# EAGLE schematic hardhat (EAGLE 5.10)
REV: 1; TITLE: Hardhat

## Sheet 1 of 4
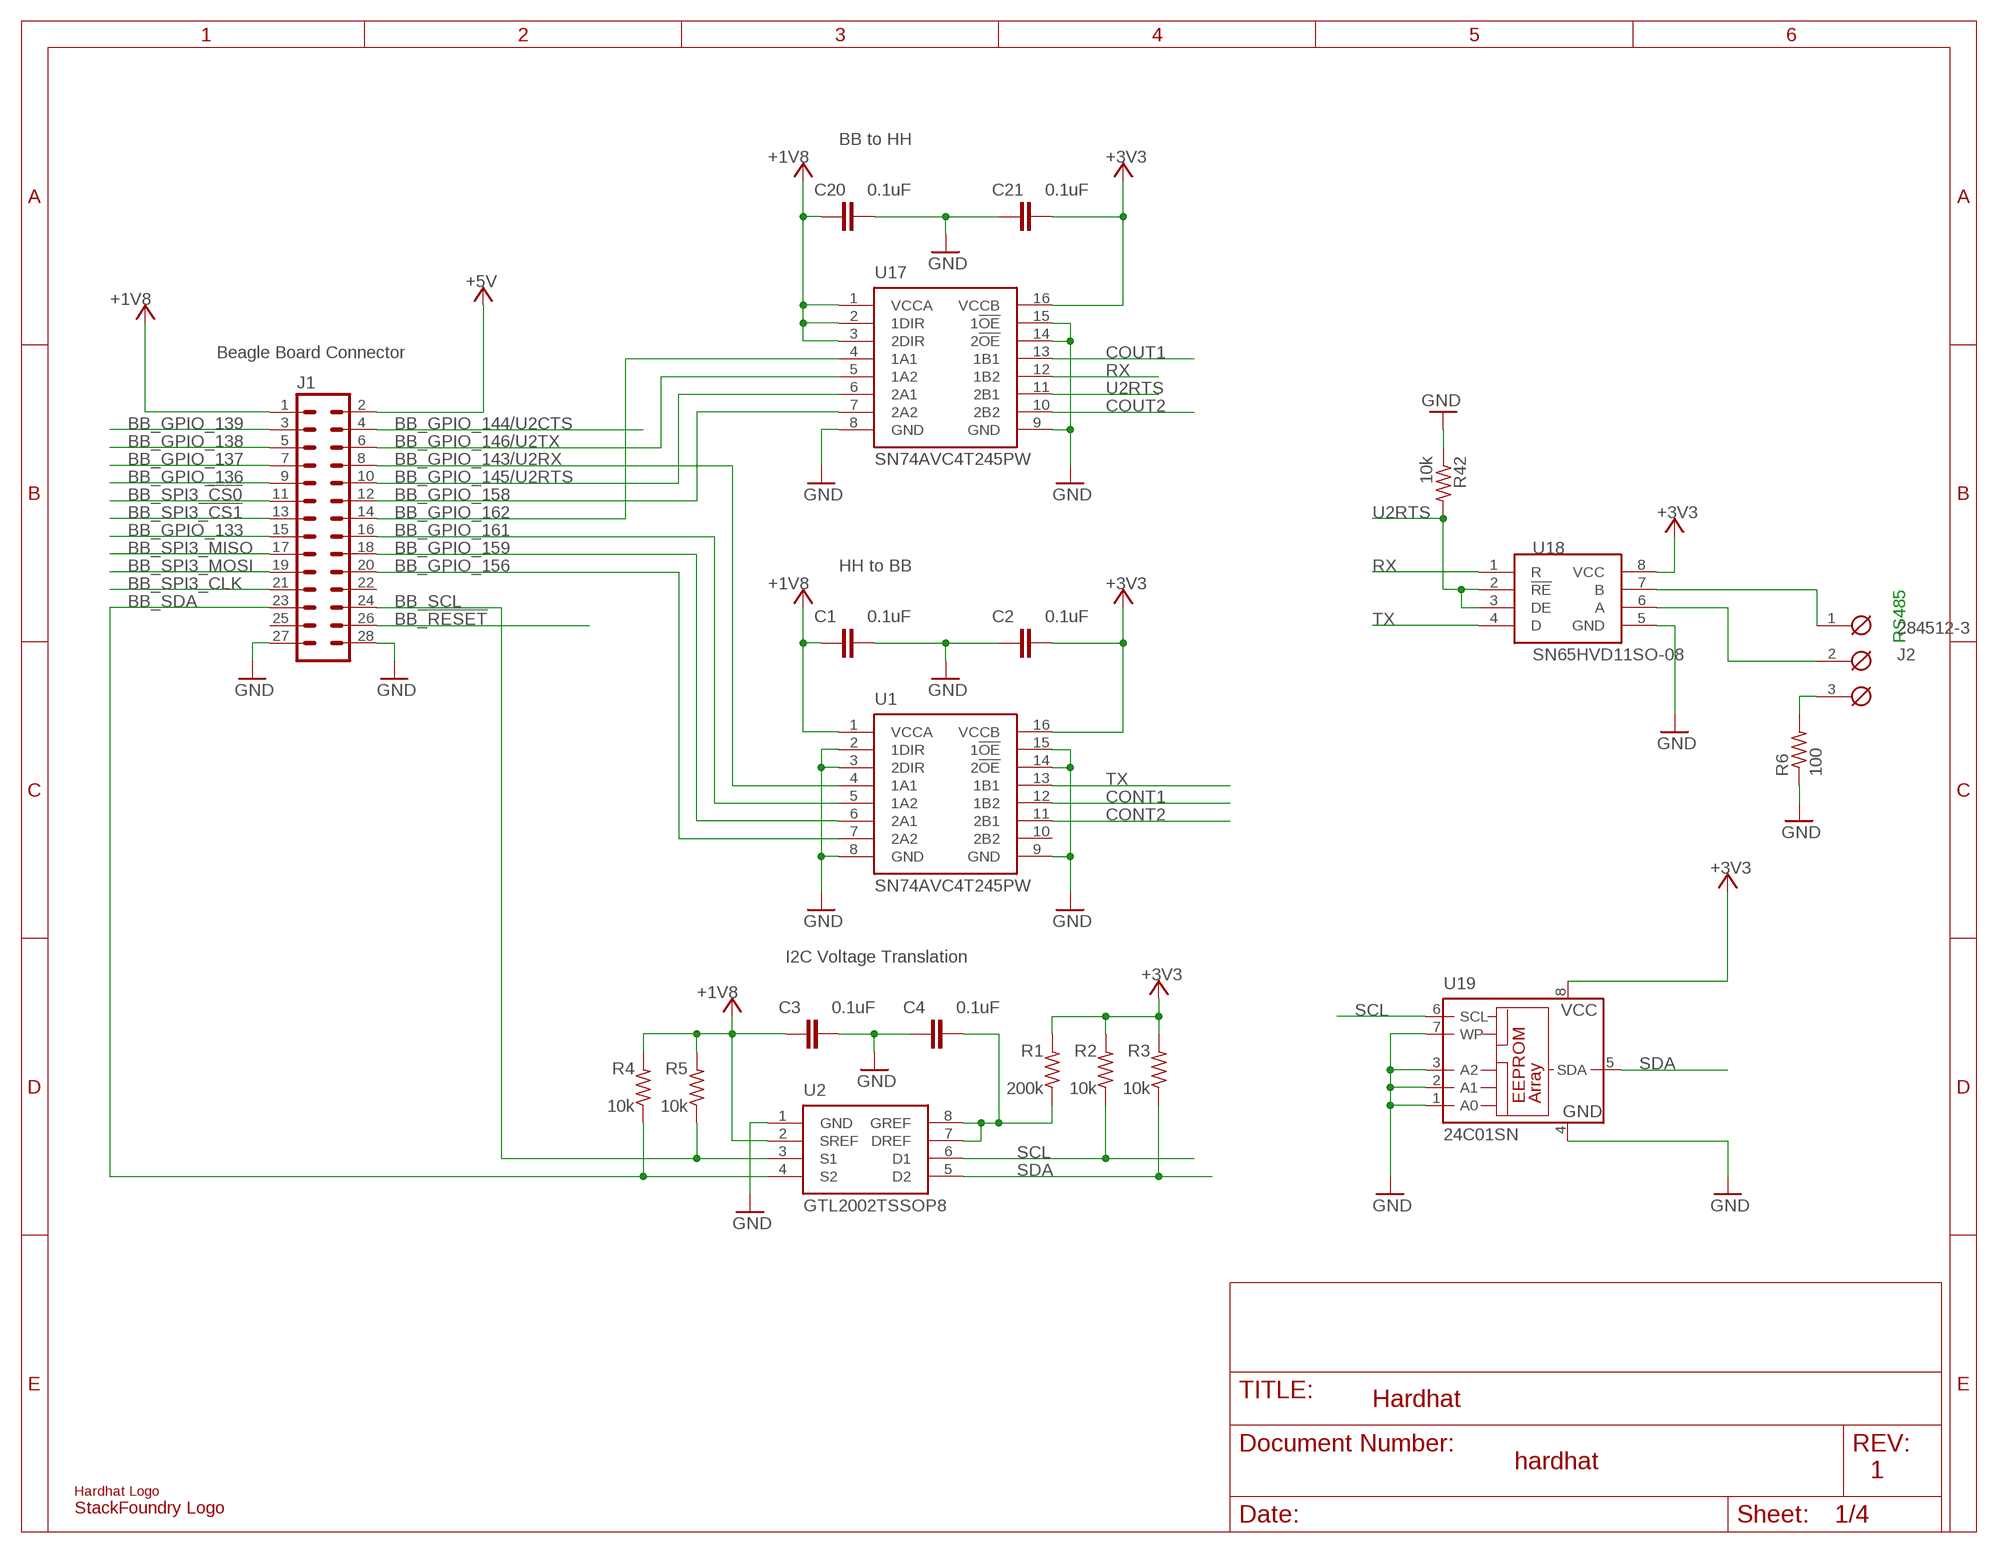
[diagram p0: schematic, sheet 1]

### Parts
C1  0.1uF  C-EUC0603  [C0603]
C2  0.1uF  C-EUC0603  [C0603]
C3  0.1uF  C-EUC0603  [C0603]
C4  0.1uF  C-EUC0603  [C0603]
C20  0.1uF  C-EUC0603  [C0603]
C21  0.1uF  C-EUC0603  [C0603]
J1  MA14-2MA14-2M  [MA14-2M]
J2  284512-3  [284512-3]
LOGO1  SFLOGO  [SFLOGO]
R1  200k  R-US_R0603  [R0603]
R2  10k  R-US_R0603  [R0603]
R3  10k  R-US_R0603  [R0603]
R4  10k  R-US_R0603  [R0603]
R5  10k  R-US_R0603  [R0603]
R6  100  R-US_R0603  [R0603]
R42  10k  R-US_R0603  [R0603]
U1  SN74AVC4T245PW  [TSSOP16]
U2  GTL2002TSSOP8  [TSSOP-8]
U17  SN74AVC4T245PW  [TSSOP16]
U18  SN65HVD11SO-08  [SO-08]
U19  24C01SN  [SO-08]
U$1  BEAGLE_HARDHAT  [BEAGLE_HARDHAT]

### Nets
+1V8: C1.1 C3.1 C20.1 J1.1 R4.2 R5.2 U1.1(VCCA) U2.2(SREF) U17.1(VCCA) U17.2(1DIR) U17.3(2DIR)
+3V3: C2.1 C21.1 R1.2 R2.2 R3.2 U1.16(VCCB) U17.16(VCCB) U18.8(VCC) U19.8(VCC) ; also sheet 2,3,4
+5V: J1.2 ; also sheet 2,4
BB_!RESET: J1.26
BB_GPIO_133: J1.15
BB_GPIO_136: J1.9
BB_GPIO_137: J1.7
BB_GPIO_138: J1.5
BB_GPIO_139: J1.3
BB_GPIO_143/U2RX: J1.8 U1.4(1A1)
BB_GPIO_144/U2CTS: J1.4
BB_GPIO_145/U2RTS: J1.10 U17.6(2A1)
BB_GPIO_146/U2TX: J1.6 U17.5(1A2)
BB_GPIO_156: J1.20 U1.7(2A2)
BB_GPIO_158: J1.12 U17.7(2A2)
BB_GPIO_159: J1.18 U1.6(2A1)
BB_GPIO_161: J1.16 U1.5(1A2)
BB_GPIO_162: J1.14 U17.4(1A1)
BB_SCL: J1.24 R5.1 U2.3(S1)
BB_SDA: J1.23 R4.1 U2.4(S2)
BB_SPI3_!CS0: J1.11
BB_SPI3_!CS1: J1.13
BB_SPI3_CLK: J1.21
BB_SPI3_MISO: J1.17
BB_SPI3_MOSI: J1.19
CONT1: U1.12(1B2) ; also sheet 3
CONT2: U1.11(2B1) ; also sheet 3
COUT1: U17.13(1B1) ; also sheet 3
COUT2: U17.10(2B2) ; also sheet 3
GND: C1.2 C2.2 C3.2 C4.2 C20.2 C21.2 J1.27 J1.28 R6.1 R42.1 U1.2(1DIR) U1.3(2DIR) U1.8(GND) U1.9(GND) U1.14(2!OE) U1.15(1!OE) U2.1(GND) U17.8(GND) U17.9(GND) U17.14(2!OE) U17.15(1!OE) U18.5(GND) U19.1(A0) U19.2(A1) U19.3(A2) U19.4(GND) U19.7(WP) ; also sheet 2,3,4
N$8: J2.1 U18.7(B)
N$12: J2.3 R6.2
N$17: C4.1 R1.1 U2.7(DREF) U2.8(GREF)
N$51: J2.2 U18.6(A)
RX: U17.12(1B2) U18.1(R)
SCL: R2.1 U2.6(D1) U19.6(SCL) ; also sheet 3,4
SDA: R3.1 U2.5(D2) U19.5(SDA) ; also sheet 3,4
TX: U1.13(1B1) U18.4(D)
U2RTS: R42.2 U17.11(2B1) U18.2(!RE) U18.3(DE)
Unconnected: J1.22 J1.25 U1.10(2B2)

### Notes on the sheet
- BB to HH
- Beagle Board Connector
- HH to BB
- RS485
- I2C Voltage Translation

## Sheet 2 of 4
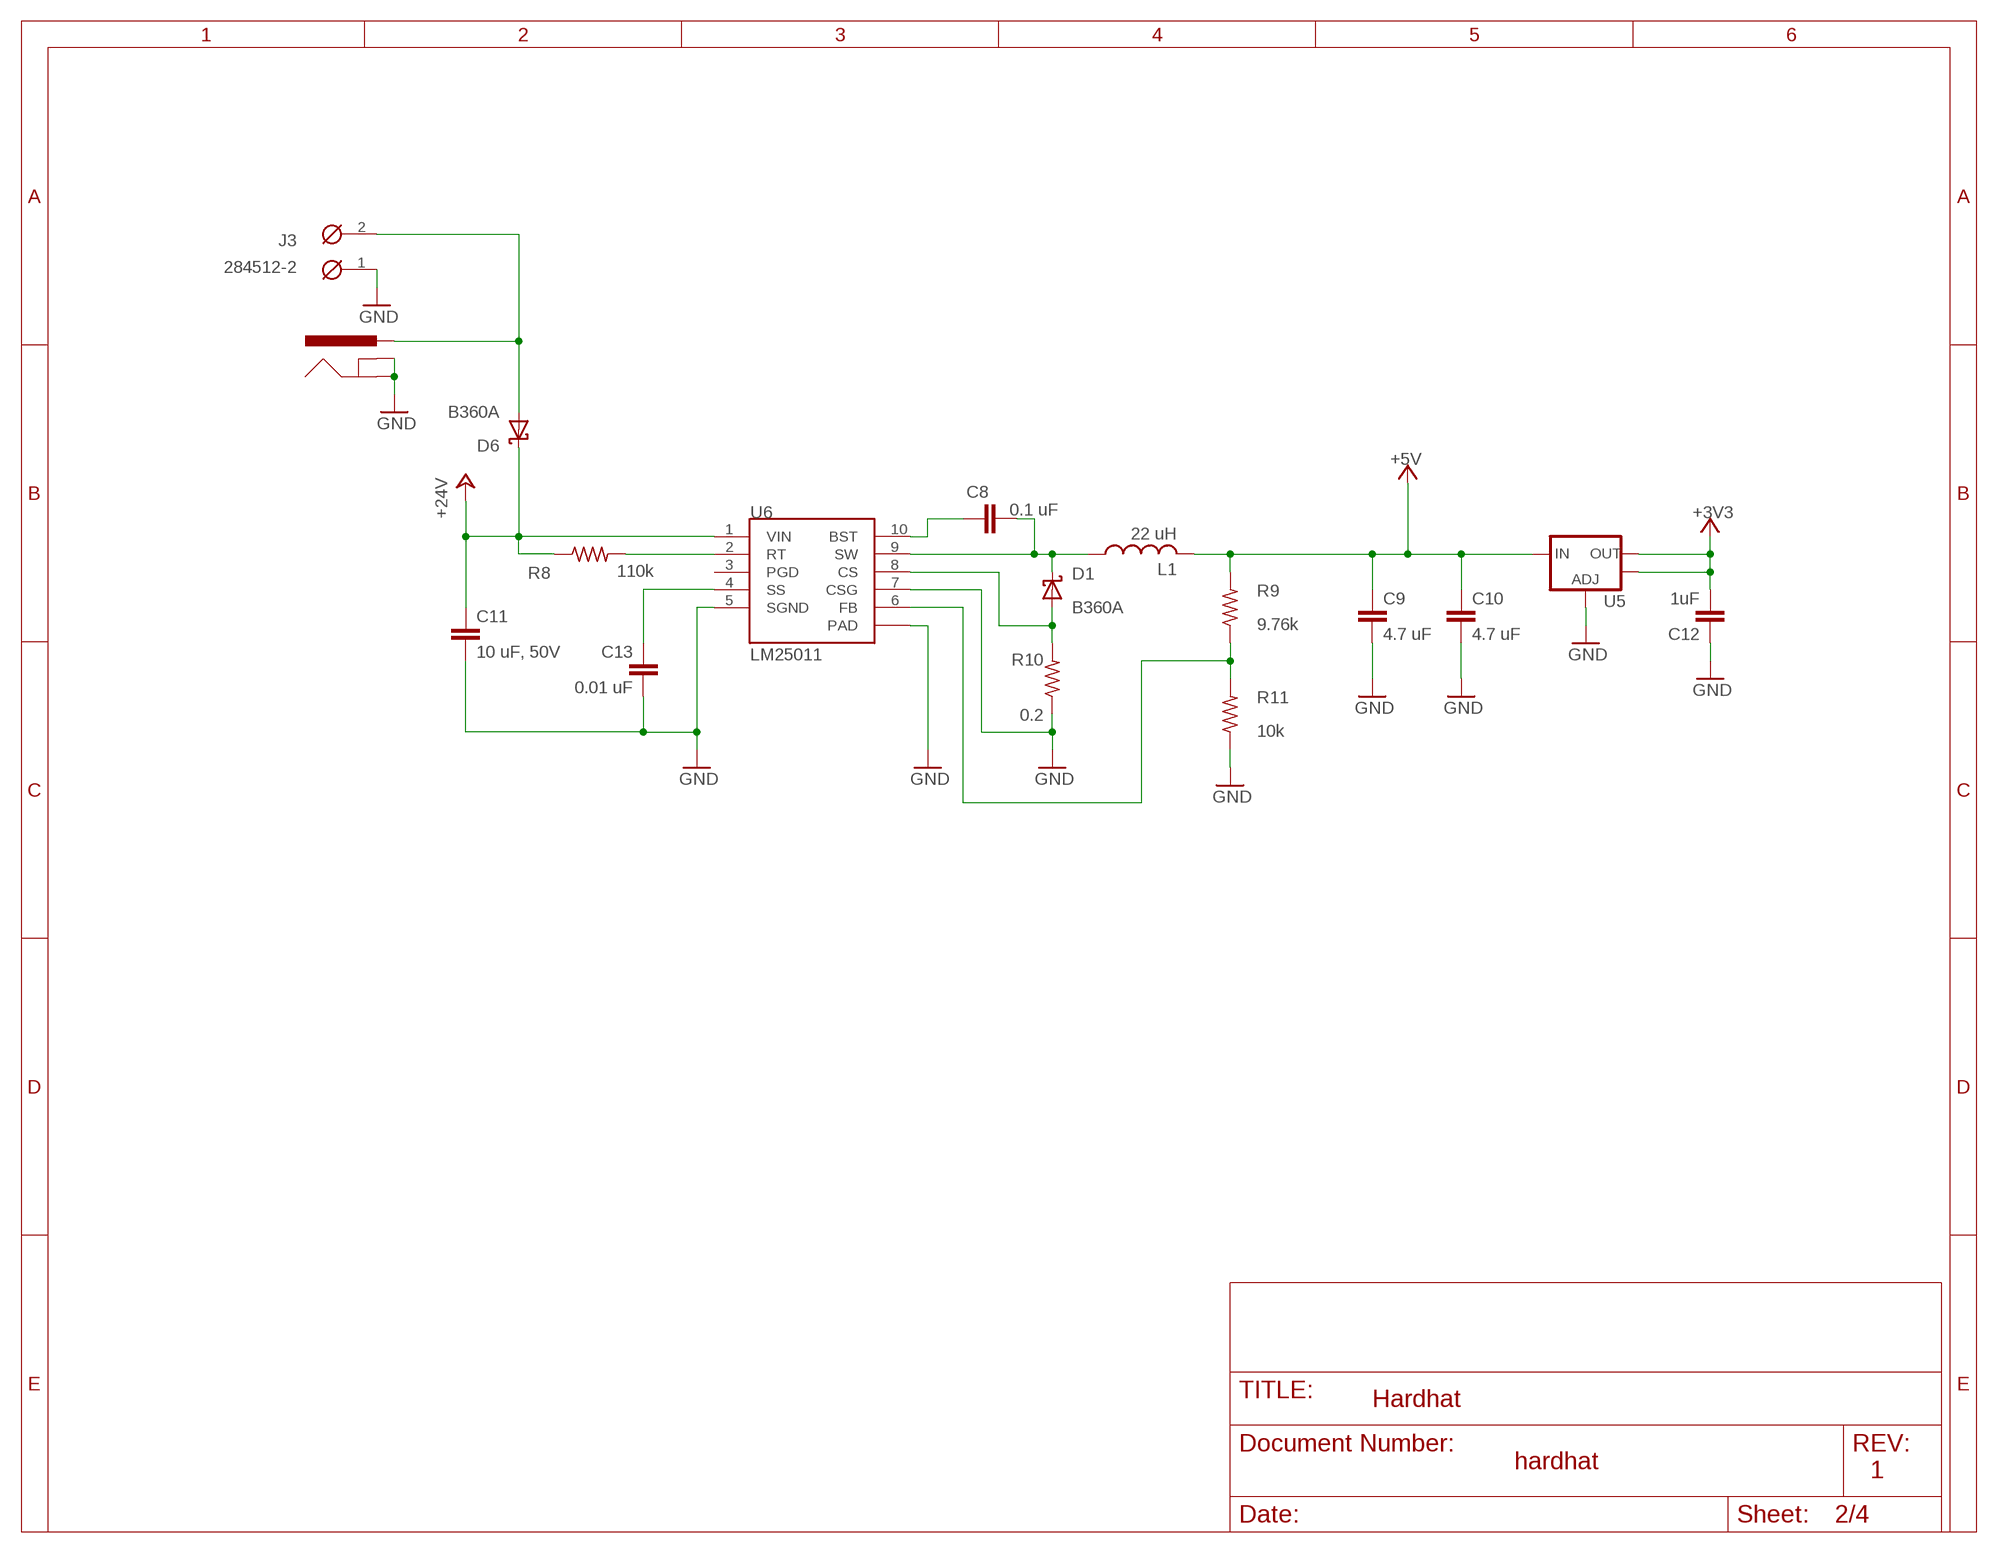
[diagram p1: schematic, sheet 2]

### Parts
C8  0.1 uF  C-EUC0603  [C0603]
C9  4.7 uF  C-EUC0805  [C0805]
C10  4.7 uF  C-EUC0805  [C0805]
C11  10 uF, 50V  C-EUC1210  [C1210]
C12  1uF  C-EUC0603  [C0603]
C13  0.01 uF  C-EUC0603  [C0603]
D1  B360A  SCHOTTKY-DIODESMA  [SMA]
D6  B360A  SCHOTTKY-DIODESMA  [SMA]
J3  284512-2  [284512-2]
J4  POWER_JACKPTH  [POWER_JACK_PTH]
L1  22 uH  L-USELL6  [ELL6]
R8  110k  R-US_R0603  [R0603]
R9  9.76k  R-US_R0603  [R0603]
R10  0.2  R-US_R0805  [R0805]
R11  10k  R-US_R0603  [R0603]
U5  V_REG_LM1117SOT223  [SOT223]
U6  LM25011  [MSSOP-10]

### Nets
+3V3: C12.2 U5.2(OUT) U5.4(OUT) ; also sheet 1,3,4
+5V: C9.1 C10.1 L1.2 R9.2 U5.3(IN) ; also sheet 1,4
+24V: C11.1 D6.C R8.1 U6.1(VIN) ; also sheet 3,4
GND: C9.2 C10.2 C11.2 C12.1 C13.2 J3.1 J4.GND J4.GNDBREAK R10.1 R11.1 U5.1(ADJ) U6.5(SGND) U6.7(CSG) U6.P$1(PAD) ; also sheet 1,3,4
N$11: D6.A J3.2 J4.PWR
N$131: D1.A R10.2 U6.8(CS)
N$135: C8.2 D1.C L1.1 U6.9(SW)
N$158: R9.1 R11.2 U6.6(FB)
N$159: C8.1 U6.10(BST)
N$160: C13.1 U6.4(SS)
N$173: R8.2 U6.2(RT)
Unconnected: U6.3(PGD)

## Sheet 3 of 4
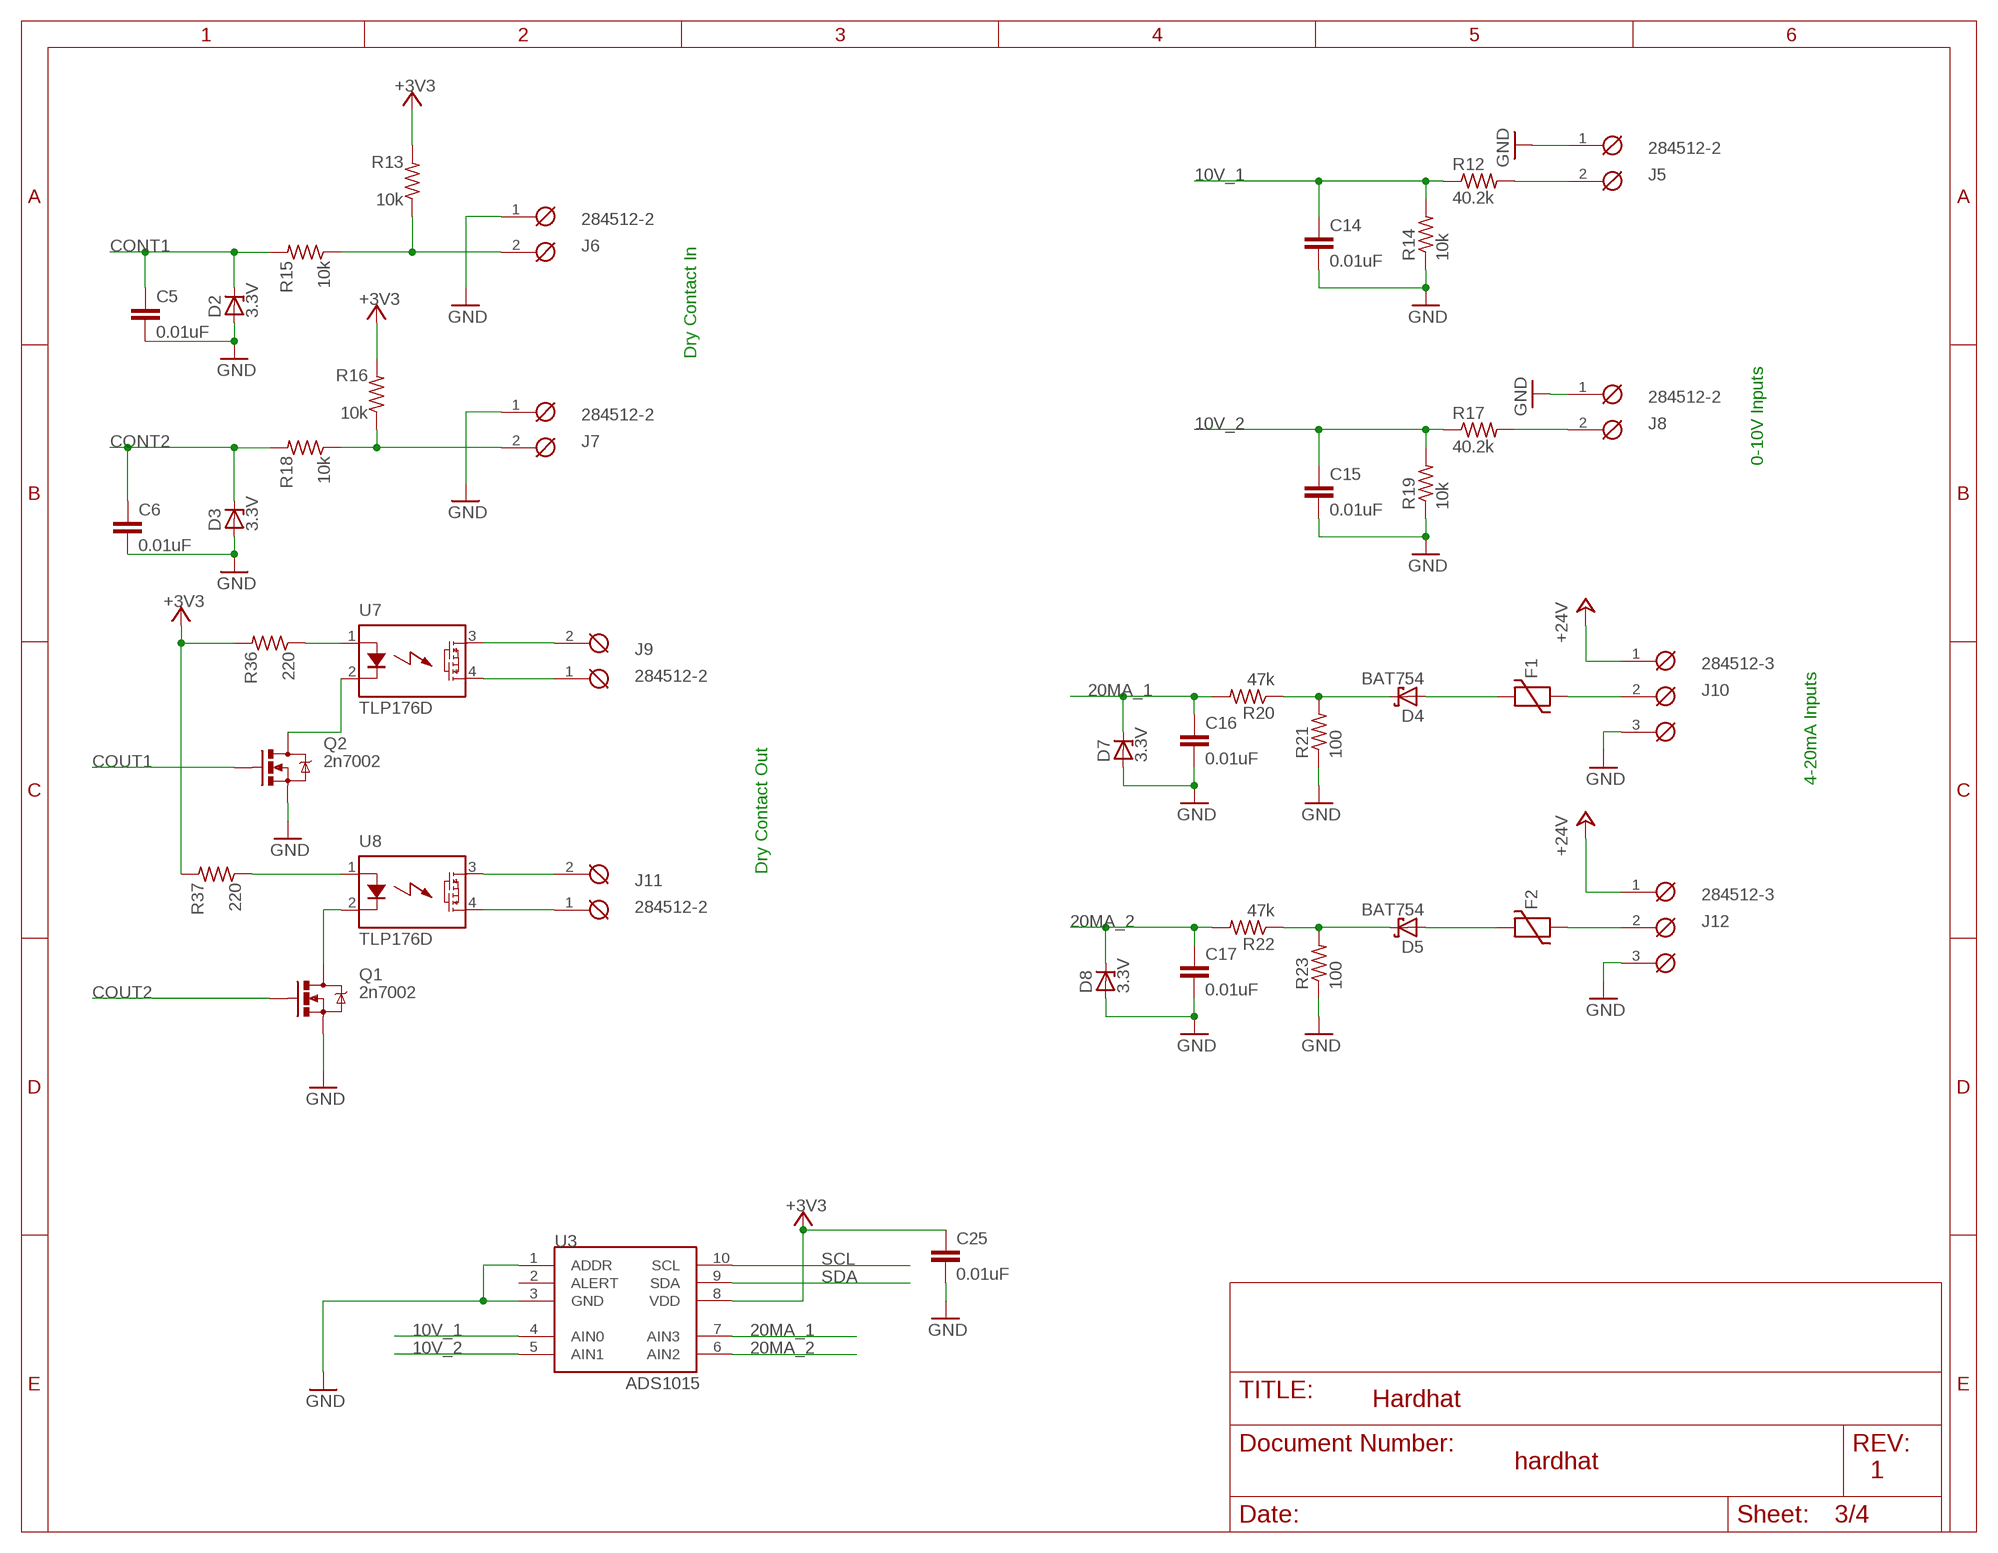
[diagram p2: schematic, sheet 3]

### Parts
C5  0.01uF  C-EUC0603  [C0603]
C6  0.01uF  C-EUC0603  [C0603]
C14  0.01uF  C-EUC0603  [C0603]
C15  0.01uF  C-EUC0603  [C0603]
C16  0.01uF  C-EUC0603  [C0603]
C17  0.01uF  C-EUC0603  [C0603]
C25  0.01uF  C-EUC0603  [C0603]
D2  3.3V  ZENER-DIODESOD80C  [SOD80C]
D3  3.3V  ZENER-DIODESOD80C  [SOD80C]
D4  BAT754  BAT54LT1  [SOT23]
D5  BAT754  BAT54LT1  [SOT23]
D7  3.3V  ZENER-DIODESOD80C  [SOD80C]
D8  3.3V  ZENER-DIODESOD80C  [SOD80C]
F1  PTC1206  [R1206]
F2  PTC1206  [R1206]
J5  284512-2  [284512-2]
J6  284512-2  [284512-2]
J7  284512-2  [284512-2]
J8  284512-2  [284512-2]
J9  284512-2  [284512-2]
J10  284512-3  [284512-3]
J11  284512-2  [284512-2]
J12  284512-3  [284512-3]
Q1  2n7002  MOSFET-NCHANNELSMD  [SOT23-3]
Q2  2n7002  MOSFET-NCHANNELSMD  [SOT23-3]
R12  40.2k  R-US_R0603  [R0603]
R13  10k  R-US_R0603  [R0603]
R14  10k  R-US_R0603  [R0603]
R15  10k  R-US_R0603  [R0603]
R16  10k  R-US_R0603  [R0603]
R17  40.2k  R-US_R0603  [R0603]
R18  10k  R-US_R0603  [R0603]
R19  10k  R-US_R0603  [R0603]
R20  47k  R-US_R0603  [R0603]
R21  100  R-US_R0603  [R0603]
R22  47k  R-US_R0603  [R0603]
R23  100  R-US_R0603  [R0603]
R36  220  R-US_R0603  [R0603]
R37  220  R-US_R0603  [R0603]
U3  ADS1015  ADS101X/ADS11XX  [MSOP10]
U7  TLP176D  [SOP4]
U8  TLP176D  [SOP4]

### Nets
10V_1: C14.1 R12.1 R14.2 U3.4(AIN0)
10V_2: C15.1 R17.1 R19.2 U3.5(AIN1)
20MA_1: C16.1 D7.C R20.2 U3.7(AIN3)
20MA_2: C17.1 D8.C R22.2 U3.6(AIN2)
+3V3: C25.1 R13.2 R16.2 R36.2 R37.2 U3.8(VDD) ; also sheet 1,2,4
+24V: J10.1 J12.1 ; also sheet 2,4
CONT1: C5.1 D2.C R15.2 ; also sheet 1
CONT2: C6.1 D3.C R18.2 ; also sheet 1
COUT1: Q2.1(G) ; also sheet 1
COUT2: Q1.1(G) ; also sheet 1
GND: C5.2 C6.2 C14.2 C15.2 C16.2 C17.2 C25.2 D2.A D3.A D7.A D8.A J5.1 J6.1 J7.1 J8.1 J10.3 J12.3 Q1.2(S) Q2.2(S) R14.1 R19.1 R21.1 R23.1 U3.1(ADDR) U3.3(GND) ; also sheet 1,2,4
N$1: J9.2 U7.3(DS1)
N$3: J6.2 R13.1 R15.1
N$4: J9.1 U7.4(DS2)
N$5: J11.2 U8.3(DS1)
N$6: J7.2 R16.1 R18.1
N$7: J11.1 U8.4(DS2)
N$9: J5.2 R12.2
N$10: J8.2 R17.2
N$31: D5.1(A) F2.1
N$32: D5.3(C) R22.1 R23.2
N$34: D4.3(C) R20.1 R21.2
N$35: F2.2 J12.2
N$37: R36.1 U7.1(A)
N$38: D4.1(A) F1.1
N$39: F1.2 J10.2
N$40: R37.1 U8.1(A)
N$41: Q2.3(D) U7.2(K)
N$42: Q1.3(D) U8.2(K)
SCL: U3.10(SCL) ; also sheet 1,4
SDA: U3.9(SDA) ; also sheet 1,4
Unconnected: U3.2(ALERT)

### Notes on the sheet
- Dry Contact In
- 0-10V Inputs
- 4-20mA Inputs
- Dry Contact Out

## Sheet 4 of 4
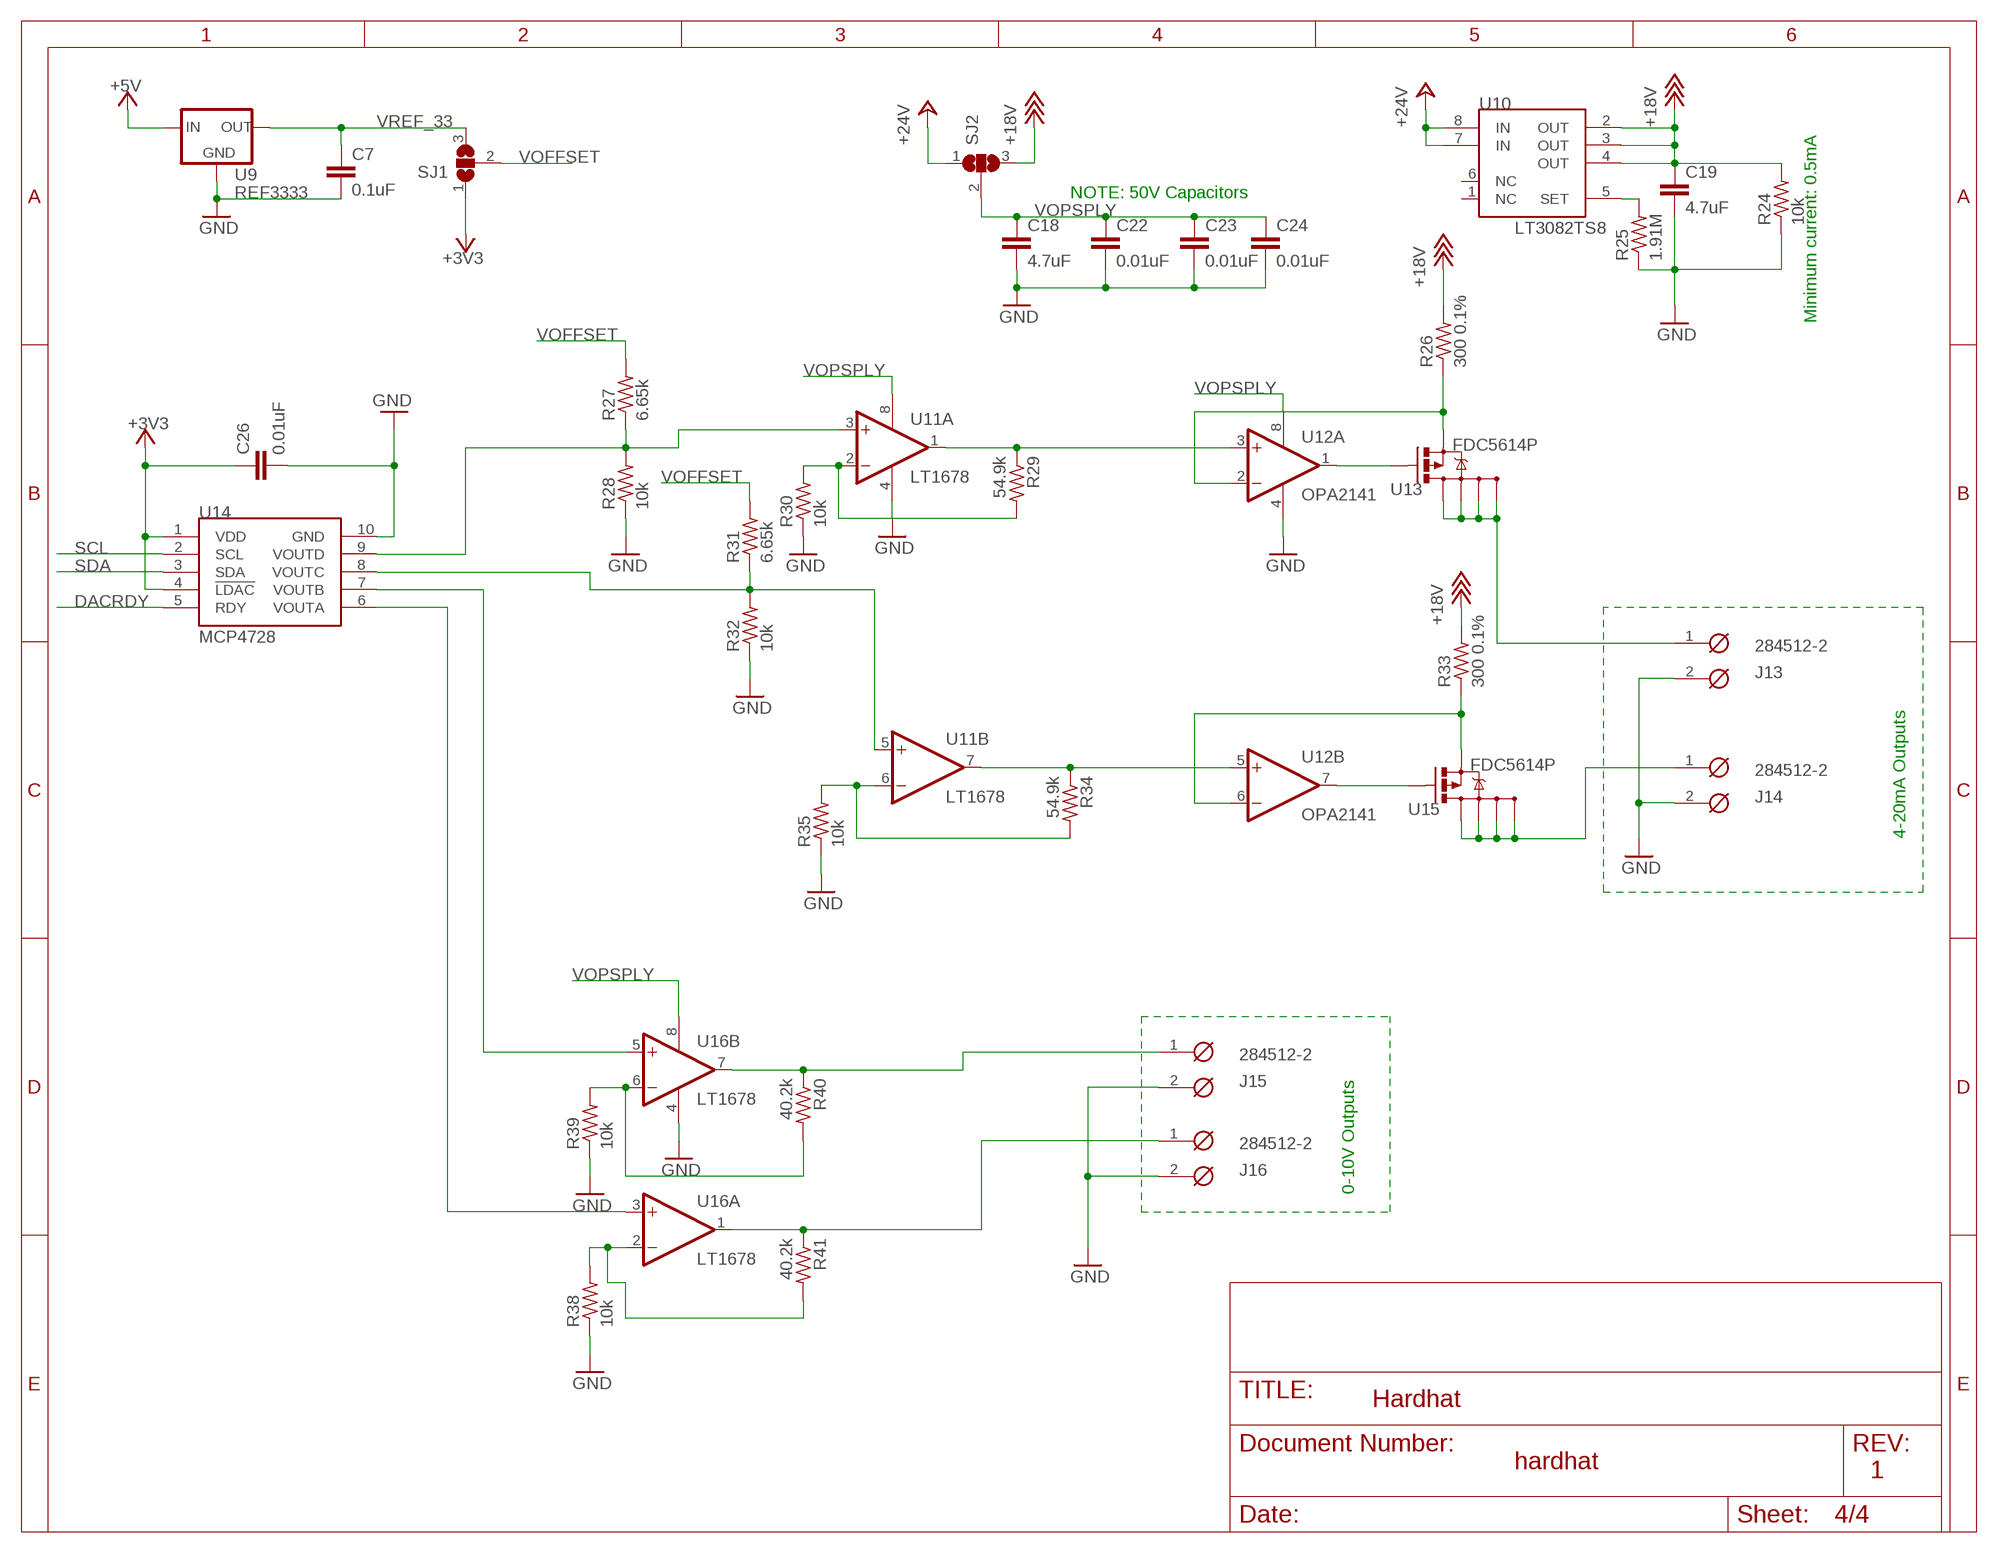
[diagram p3: schematic, sheet 4]

### Parts
C7  0.1uF  C-EUC0603  [C0603]
C18  4.7uF  C-EUC1206  [C1206]
C19  4.7uF  C-EUC1206  [C1206]
C22  0.01uF  C-EUC0603  [C0603]
C23  0.01uF  C-EUC0603  [C0603]
C24  0.01uF  C-EUC0603  [C0603]
C26  0.01uF  C-EUC0603  [C0603]
J13  284512-2  [284512-2]
J14  284512-2  [284512-2]
J15  284512-2  [284512-2]
J16  284512-2  [284512-2]
R24  10k  R-US_R0603  [R0603]
R25  1.91M  R-US_R0805  [R0805]
R26  300 0.1%  R-US_R1206  [R1206]
R27  6.65k  R-US_R0603  [R0603]
R28  10k  R-US_R0603  [R0603]
R29  54.9k  R-US_R0603  [R0603]
R30  10k  R-US_R0603  [R0603]
R31  6.65k  R-US_R0603  [R0603]
R32  10k  R-US_R0603  [R0603]
R33  300 0.1%  R-US_R1206  [R1206]
R34  54.9k  R-US_R0603  [R0603]
R35  10k  R-US_R0603  [R0603]
R38  10k  R-US_R0603  [R0603]
R39  10k  R-US_R0603  [R0603]
R40  40.2k  R-US_R0603  [R0603]
R41  40.2k  R-US_R0603  [R0603]
SJ1  SOLDERJUMPER_2WAYS  [SJ_3]
SJ2  SOLDERJUMPER_2WAYS  [SJ_3]
U9  REF3333  ADR370  [SOT23]
U10  LT3082TS8  [TS8]
U11  LT1678  TL082D  [SO08]
U12  OPA2141  TL082D  [SO08]
U13  FDC5614P  [SSOT-6]
U14  MCP4728  [MSOP10]
U15  FDC5614P  [SSOT-6]
U16  LT1678  TL082D  [SO08]

### Nets
+3V3: C26.1 SJ1.1 U14.1(VDD) U14.4(!LDAC) ; also sheet 1,2,3
+5V: U9.1(IN) ; also sheet 1,2
+18V: C19.1 R24.2 R26.2 R33.2 SJ2.3 U10.2(OUT) U10.3(OUT) U10.4(OUT)
+24V: SJ2.1 U10.7(IN) U10.8(IN) ; also sheet 2,3
DACRDY: U14.5(RDY)
GND: C7.2 C18.2 C19.2 C22.2 C23.2 C24.2 C26.2 J13.2 J14.2 J15.2 J16.2 R24.1 R25.1 R28.1 R30.1 R32.1 R35.1 R38.1 R39.1 U9.3(GND) U11.4(P:V-) U12.4(P:V-) U14.10(GND) U16.4(P:V-) ; also sheet 1,2,3
N$16: R27.1 R28.2 U11.3(A:+IN) U14.9(VOUTD)
N$18: R31.1 R32.2 U11.5(B:+IN) U14.8(VOUTC)
N$19: R29.2 R30.2 U11.2(A:-IN)
N$20: R29.1 U11.1(A:OUT) U12.3(A:+IN)
N$21: R34.1 U11.7(B:OUT) U12.5(B:+IN)
N$22: R34.2 R35.2 U11.6(B:-IN)
N$23: R25.2 U10.5(SET)
N$24: U12.1(A:OUT) U13.3(G)
N$25: U12.7(B:OUT) U15.3(G)
N$26: R33.1 U12.6(B:-IN) U15.4(S)
N$27: R26.1 U12.2(A:-IN) U13.4(S)
N$28: J13.1 U13.1(D) U13.2(D1) U13.5(D2) U13.6(D3)
N$29: J14.1 U15.1(D) U15.2(D1) U15.5(D2) U15.6(D3)
N$43: J15.1 R40.1 U16.7(B:OUT)
N$44: J16.1 R41.1 U16.1(A:OUT)
N$45: U14.7(VOUTB) U16.5(B:+IN)
N$46: U14.6(VOUTA) U16.3(A:+IN)
N$47: R39.2 R40.2 U16.6(B:-IN)
N$48: R38.2 R41.2 U16.2(A:-IN)
SCL: U14.2(SCL) ; also sheet 1,3
SDA: U14.3(SDA) ; also sheet 1,3
VOFFSET: R27.2 R31.2 SJ1.2
VOPSPLY: C18.1 C22.1 C23.1 C24.1 SJ2.2 U11.8(P:V+) U12.8(P:V+) U16.8(P:V+)
VREF_33: C7.1 SJ1.3 U9.2(OUT)
Unconnected: U10.1(NC) U10.6(NC)

### Notes on the sheet
- NOTE: 50V Capacitors
- Minimum current: 0.5mA
- 4-20mA Outputs
- 0-10V Outputs

## Library data of the parts
C1-C26 = rcl:C-EU: CAPACITOR, European symbol
D1 D6 = diode:SCHOTTKY-DIODE: Schottky Diode
D2 D3 D7 D8 = diode:ZENER-DIODE: Z-Diode
D4 D5 = diode:BAT54LT1
F1 F2 = rcl:PTC: PTC Thermal Resetable Fuses LittelFuse PolyFuse and others
J1 = con-lstb:MA14-2
J2 J10 J12 = con-tyco:284512-3
J3 J5-J9 J11 J13-J16 = con-tyco:284512-2: Terminal Block, Header Assembly, 90°, Closed Ends, 2 Pin, 3.5mm Pitch
J4 = SparkFun:POWER_JACK: Power Jack This is the standard 5.5mm barrel jack for power. The PTH is the most common, proven, reliable, footprint. All others are experimental. The Slot footprint only works if the mill layer is transmitted to the PCB fab house so be warned. Spark Fun Electronics SKU : PRT-00119. Mating wall wart : TOL-00298 (and others)
L1 = rcl:L-US: INDUCTOR, American symbol
LOGO1 = logos:SFLOGO
Q1 Q2 = SparkFun:MOSFET-NCHANNEL
R1-R6 R8-R42 = rcl:R-US_: RESISTOR, American symbol
SJ1 SJ2 = SparkFun:SOLDERJUMPER_2WAY: Solder Jumper 2 way solder jumper
U1 U17 = texas:SN74AVC4T245: 4-Bit Dual-Supply Bus Transceiver with Configurable Voltage Translation and 3-State Outputs
U2 = nxp:GTL2002: 2-Bit Bidirectional Low Voltage Translator
U3 = texas:ADS101X/ADS11XX: I2C Sigma-Delta ADC
U5 = SparkFun:V_REG_LM1117: Voltage Regulator LM1117 Standard adjustable voltage regulator but in SMD form. Spark Fun Electronics SKU : COM-00595
U6 = national-semiconductor:LM25011: 42V, 2A Constant On-Time Switching Regulator with Adjustable Current Limit
U7 U8 = toshiba:TLP176D: SOD4 sized opto-isloated solid state relay
U9 = analog-devices:ADR370
U10 = linear-technology:LT3082
U11 U12 U16 = linear:TL082: OP AMP
U13 U15 = fairchild-semic:FDC5614P
U14 = microchip:MCP4728
U18 = texas:SN65HVD11: 3.3V RS-485 Transceiver, Half-Duplex
U19 = microchip:24C*: Serial EEPROM 1 K/2 K/4 K
U$1 = logos:BEAGLE_HARDHAT